# Altium schematic sheet 13-IO.SchDoc
size C
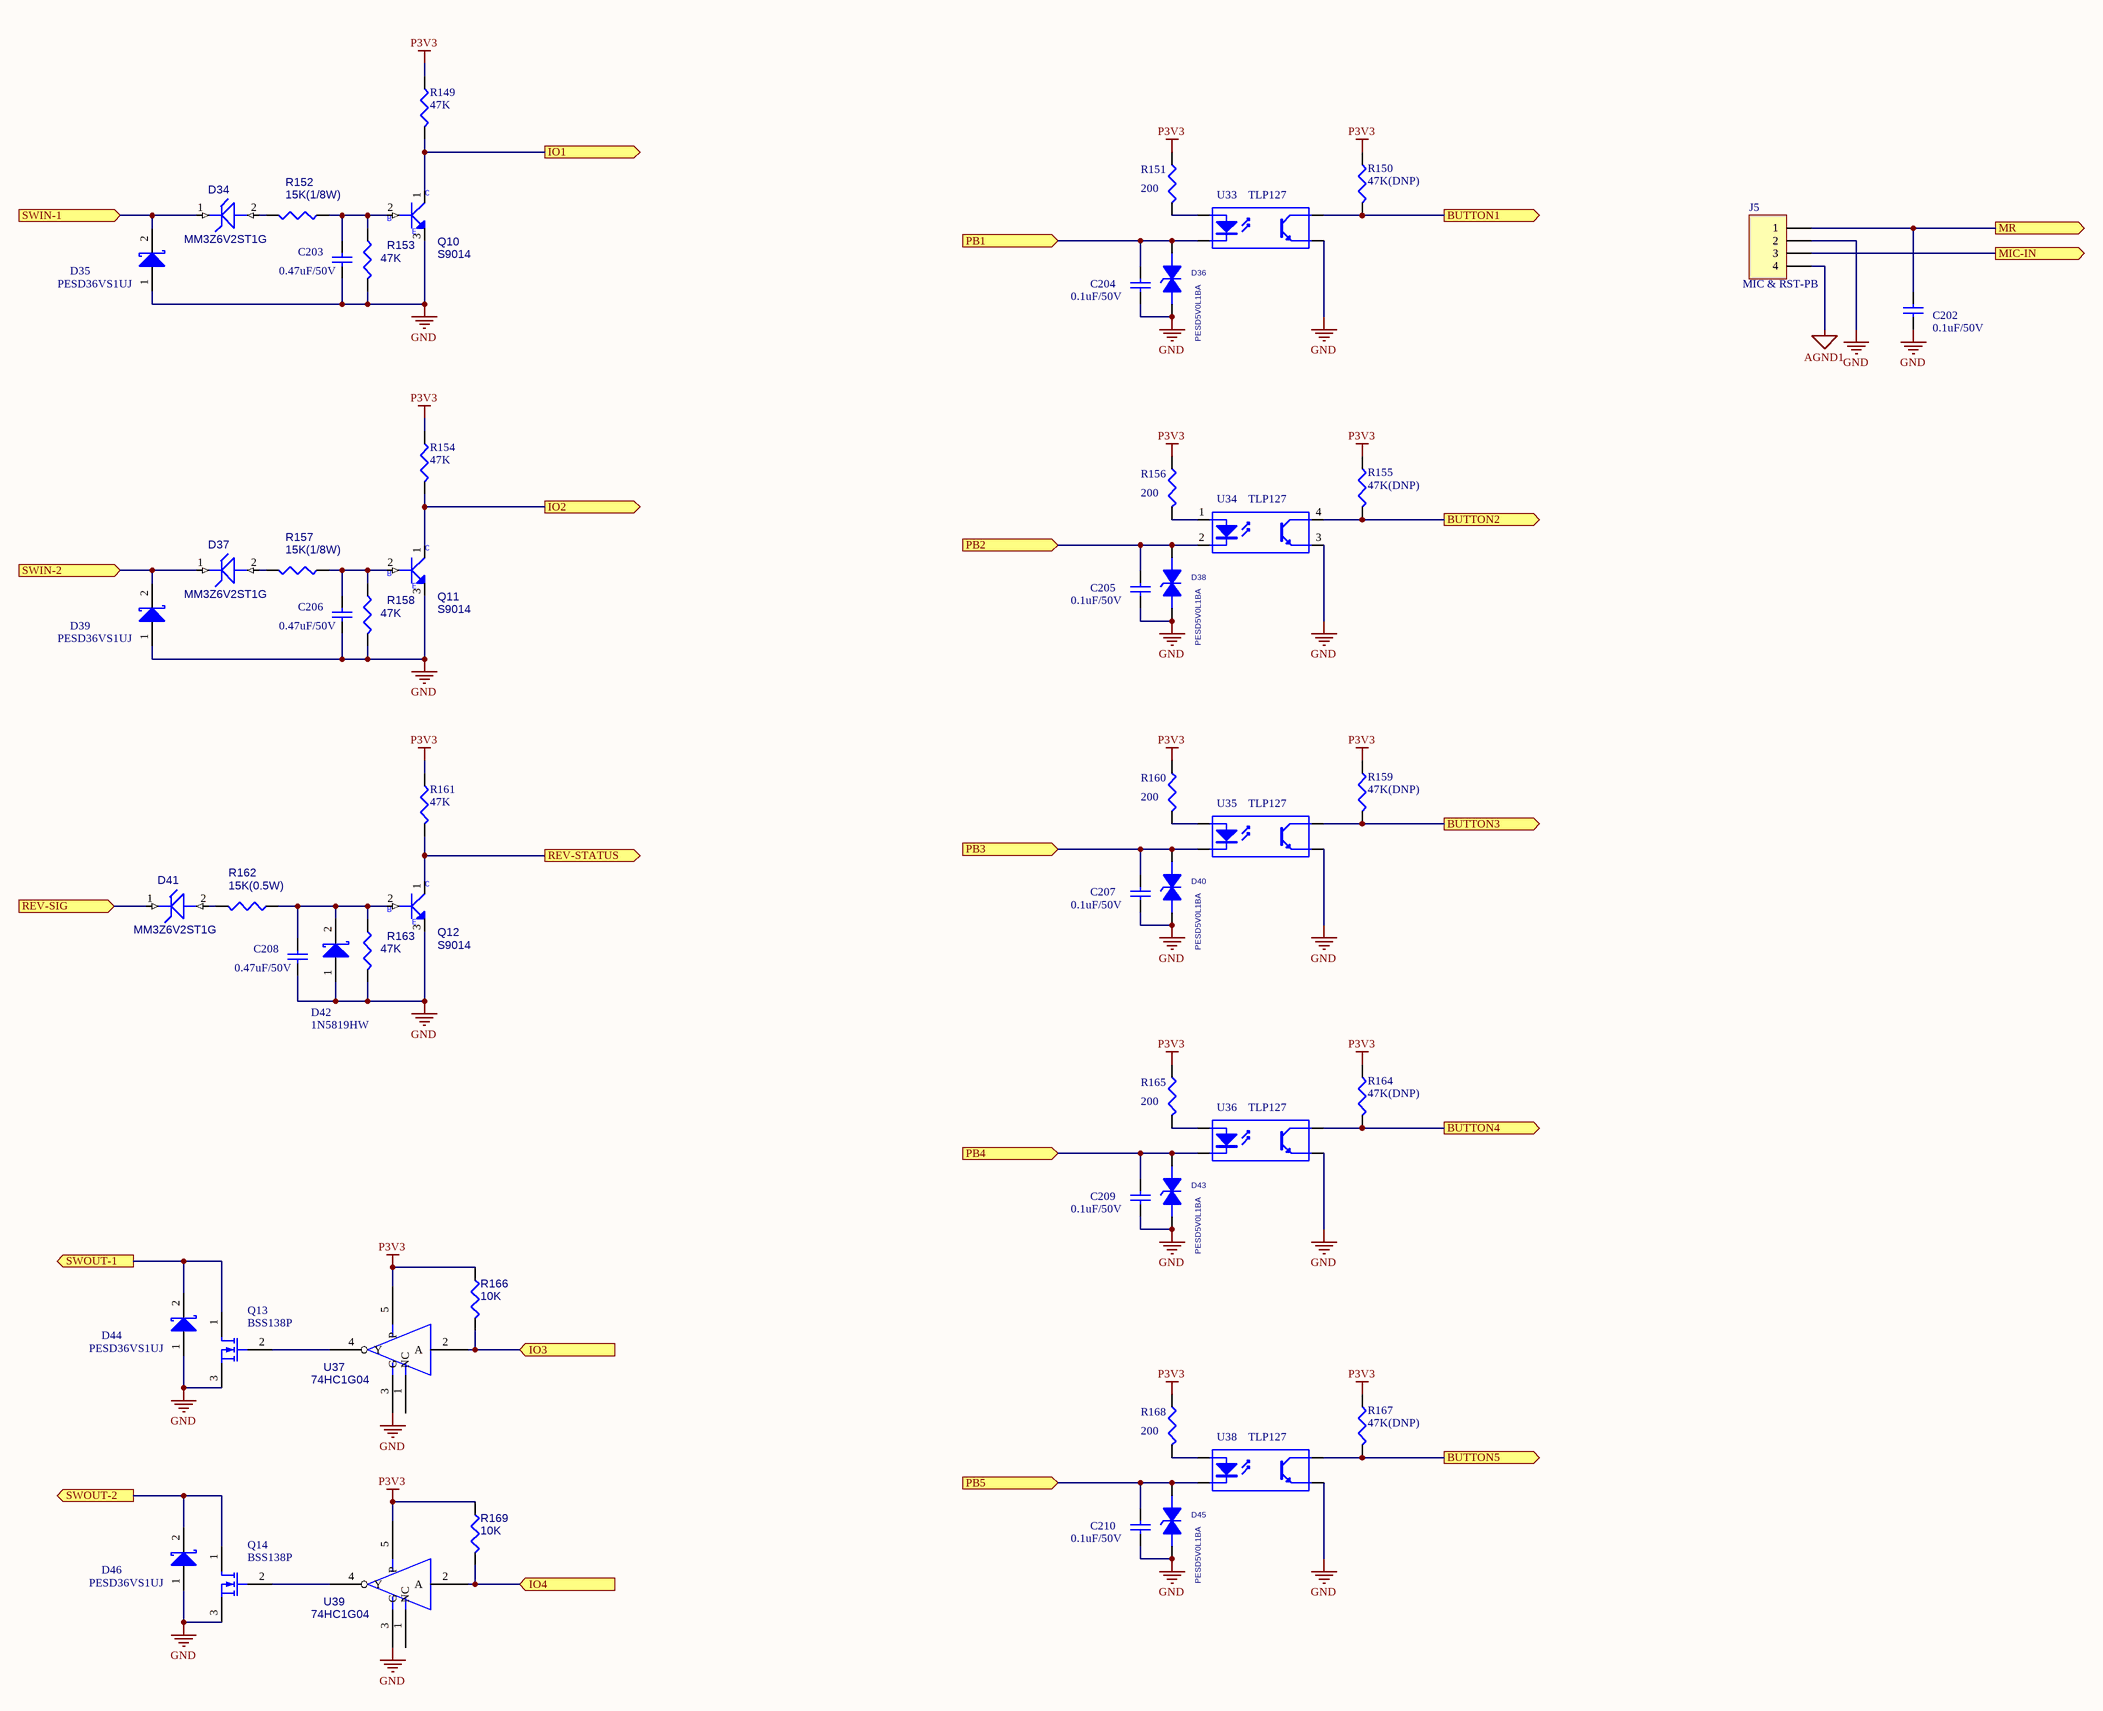
[diagram p0: 13-IO.SchDoc]

## Parts
C202  0.1uF/50V  [0402]
C203  0.47uF/50V  [0603]
C204  0.1uF/50V  [0402]
C205  0.1uF/50V  [0402]
C206  0.47uF/50V  [0603]
C207  0.1uF/50V  [0402]
C208  0.47uF/50V  [0603]
C209  0.1uF/50V  [0402]
C210  0.1uF/50V  [0402]
D34  MM3Z6V2ST1G  [SOD323F]
D35  PESD36VS1UJ  [SOD323]
D36  PESD5V0L1BA  [SOD323]
D37  MM3Z6V2ST1G  [SOD323F]
D38  PESD5V0L1BA  [SOD323]
D39  PESD36VS1UJ  [SOD323]
D40  PESD5V0L1BA  [SOD323]
D41  MM3Z6V2ST1G  [SOD323F]
D42  1N5819HW  [1N5819]
D43  PESD5V0L1BA  [SOD323]
D44  PESD36VS1UJ  [SOD323]
D45  PESD5V0L1BA  [SOD323]
D46  PESD36VS1UJ  [SOD323]
J5  MIC & RST-PB  [FPC1.0-DR-SMD-4P-F2.0]
Q10  S9014  [NPN]
Q11  S9014  [NPN]
Q12  S9014  [NPN]
Q13  BSS138P  [NPN]
Q14  BSS138P  [NPN]
R149  47K  [0402]
R150  47K(DNP)  [0402]
R151  200  [0402]
R152  15K(1/8W)  [0805]
R153  47K  [0402]
R154  47K  [0402]
R155  47K(DNP)  [0402]
R156  200  [0402]
R157  15K(1/8W)  [0805]
R158  47K  [0402]
R159  47K(DNP)  [0402]
R160  200  [0402]
R161  47K  [0402]
R162  15K(0.5W)  [1812]
R163  47K  [0402]
R164  47K(DNP)  [0402]
R165  200  [0402]
R166  10K  [0402]
R167  47K(DNP)  [0402]
R168  200  [0402]
R169  10K  [0402]
U33  TLP127  [TLP127]
U34  TLP127  [TLP127]
U35  TLP127  [TLP127]
U36  TLP127  [TLP127]
U37  74HC1G04  [SOT753]
U38  TLP127  [TLP127]
U39  74HC1G04  [SOT753]

## Ports
BUTTON1 (out), BUTTON2 (out), BUTTON3 (out), BUTTON4 (out), BUTTON5 (out), IO1 (out), IO2 (out), IO3 (in), IO4 (in), MIC-IN (out), MR (out), PB1 (in), PB2 (in), PB3 (in), PB4 (in), PB5 (in), REV-SIG (in), REV-STATUS (out), SWIN-1 (in), SWIN-2 (in), SWOUT-1 (out), SWOUT-2 (out)

## Nets
AGND1: J5.4
GND: C202.2 C203.2 C204.2 C205.2 C206.2 C207.2 C208.2 C209.2 C210.2 D35.1(A) D36.1 D38.1 D39.1(A) D40.1 D42.1(A) D43.1 D44.1(A) D45.1 D46.1(A) J5.2 Q10.3(EMITTER) Q11.3(EMITTER) Q12.3(EMITTER) Q13.3(S) Q14.3(S) R153.2 R158.2 R163.2 U33.3(E) U34.3(E) U35.3(E) U36.3(E) U37.3(G) U38.3(E) U39.3(G)
P3V3: R149.1 R150.1 R151.1 R154.1 R155.1 R156.1 R159.1 R160.1 R161.1 R164.1 R165.1 R166.1 R167.1 R168.1 R169.1 U37.5(P) U39.5(P)
BUTTON1: R150.2 U33.4(C) ; port BUTTON1
BUTTON2: R155.2 U34.4(C) ; port BUTTON2
BUTTON3: R159.2 U35.4(C) ; port BUTTON3
BUTTON4: R164.2 U36.4(C) ; port BUTTON4
BUTTON5: R167.2 U38.4(C) ; port BUTTON5
IO1: Q10.1(COLLECTOR) R149.2 ; port IO1
IO2: Q11.1(COLLECTOR) R154.2 ; port IO2
IO3: R166.2 U37.2(A) ; port IO3
IO4: R169.2 U39.2(A) ; port IO4
MIC-IN: J5.3 ; port MIC-IN
MR: C202.1 J5.1 ; port MR
PB1: C204.1 D36.2 U33.2(K) ; port PB1
PB2: C205.1 D38.2 U34.2(K) ; port PB2
PB3: C207.1 D40.2 U35.2(K) ; port PB3
PB4: C209.1 D43.2 U36.2(K) ; port PB4
PB5: C210.1 D45.2 U38.2(K) ; port PB5
REV-SIG: D41.1 ; port REV-SIG
REV-STATUS: Q12.1(COLLECTOR) R161.2 ; port REV-STATUS
SWIN-1: D34.1 D35.2(K) ; port SWIN-1
SWIN-2: D37.1 D39.2(K) ; port SWIN-2
SWOUT-1: D44.2(K) Q13.1(D) ; port SWOUT-1
SWOUT-2: D46.2(K) Q14.1(D) ; port SWOUT-2
NetC203_1: C203.1 Q10.2(BASE) R152.1 R153.1
NetC206_1: C206.1 Q11.2(BASE) R157.1 R158.1
NetC208_1: C208.1 D42.2(K) Q12.2(BASE) R162.1 R163.1
NetD34_2: D34.2 R152.2
NetD37_2: D37.2 R157.2
NetD41_2: D41.2 R162.2
NetQ13_2: Q13.2(G) U37.4(Y)
NetQ14_2: Q14.2(G) U39.4(Y)
NetR151_2: R151.2 U33.1(A)
NetR156_2: R156.2 U34.1(A)
NetR160_2: R160.2 U35.1(A)
NetR165_2: R165.2 U36.1(A)
NetR168_2: R168.2 U38.1(A)

Not connected (* = marked no-connect by the designer): U37 1(NC); U39 1(NC)

## Notes on the sheet
- (in symbol MMBT3904_NL_SOT23-3) C; B; E

## Library data of the parts
C202-C210 = Cap: Capacitor; Published: 8-Jun-2000; LatestRevisionDate: 17-Jul-2002; LatestRevisionNote: Re-released for DXP Platform.; PackageReference: RAD-0.3; Publisher: Altium Limited; PackageDescription: Radial Cap, Thru-Hole; 2 Leads; 0.3 in Pin Spacing
D34 D37 D41 = MMGZ5231BPTLL34
D35 D39 D42 D44 D46 = Diode 11DQ03: Schottky Rectifier
D36 D38 D40 D43 D45 = PESD
J5 = Header 4: Header, 4-Pin; LatestRevisionDate: 17-Jul-2002; LatestRevisionNote: Re-released for DXP Platform.; Publisher: Altium Limited
Q10-Q12 = MMBT3904_NL_SOT23-3: Part Description: S TR MMBT3904_NL NPN SOT23; Part Number: SB039040000
Q13 Q14 = MOSFET-N: N-Channel MOSFET; Published: 8-Jun-2000; LatestRevisionDate: 17-Jul-2002; LatestRevisionNote: Re-released for DXP Platform.; PackageVersion: 1995/1996; PackageReference: E3; Publisher: Altium Limited; PackageDescription: TO, Flat Index; 3 In-Line, Axial Leads; Body Dia. 4.6mm; Lead Dia. 0.5 mm (max)
R149-R151 R154-R156 R159-R161 R164 R165 R167 R168 = CR16-1003FM
R152 R153 R157 R158 R162 R163 R166 R169 = R
U33-U36 U38 = Optoisolator1: 4-Pin Phototransistor Optocoupler; Published: 24-Mar-1999; LatestRevisionDate: 04-Mar-2005; LatestRevisionNote: Sch pins 3 & 4 Swapped.; DatasheetVersion: Nov-2003; PackageReference: DIP-4; Publisher: Altium Limited
U37 U39 = 74LVC1G04GW_SOT353-5: Part  Number: SA00000FX00